# EasyEDA Pro project e-paper_ESP32-Pico-D4.epro

# Schematic ePaper
Create Date: 2024-11-13; Page Name: P1; Project Name: epaper; Schematic Name: ePaper; Update Date: 2024-11-18; Company: 嘉立创EDA; Drawed: Eikou; Page Size: A4; Reviewed: Bytecoin; Version: V1.0
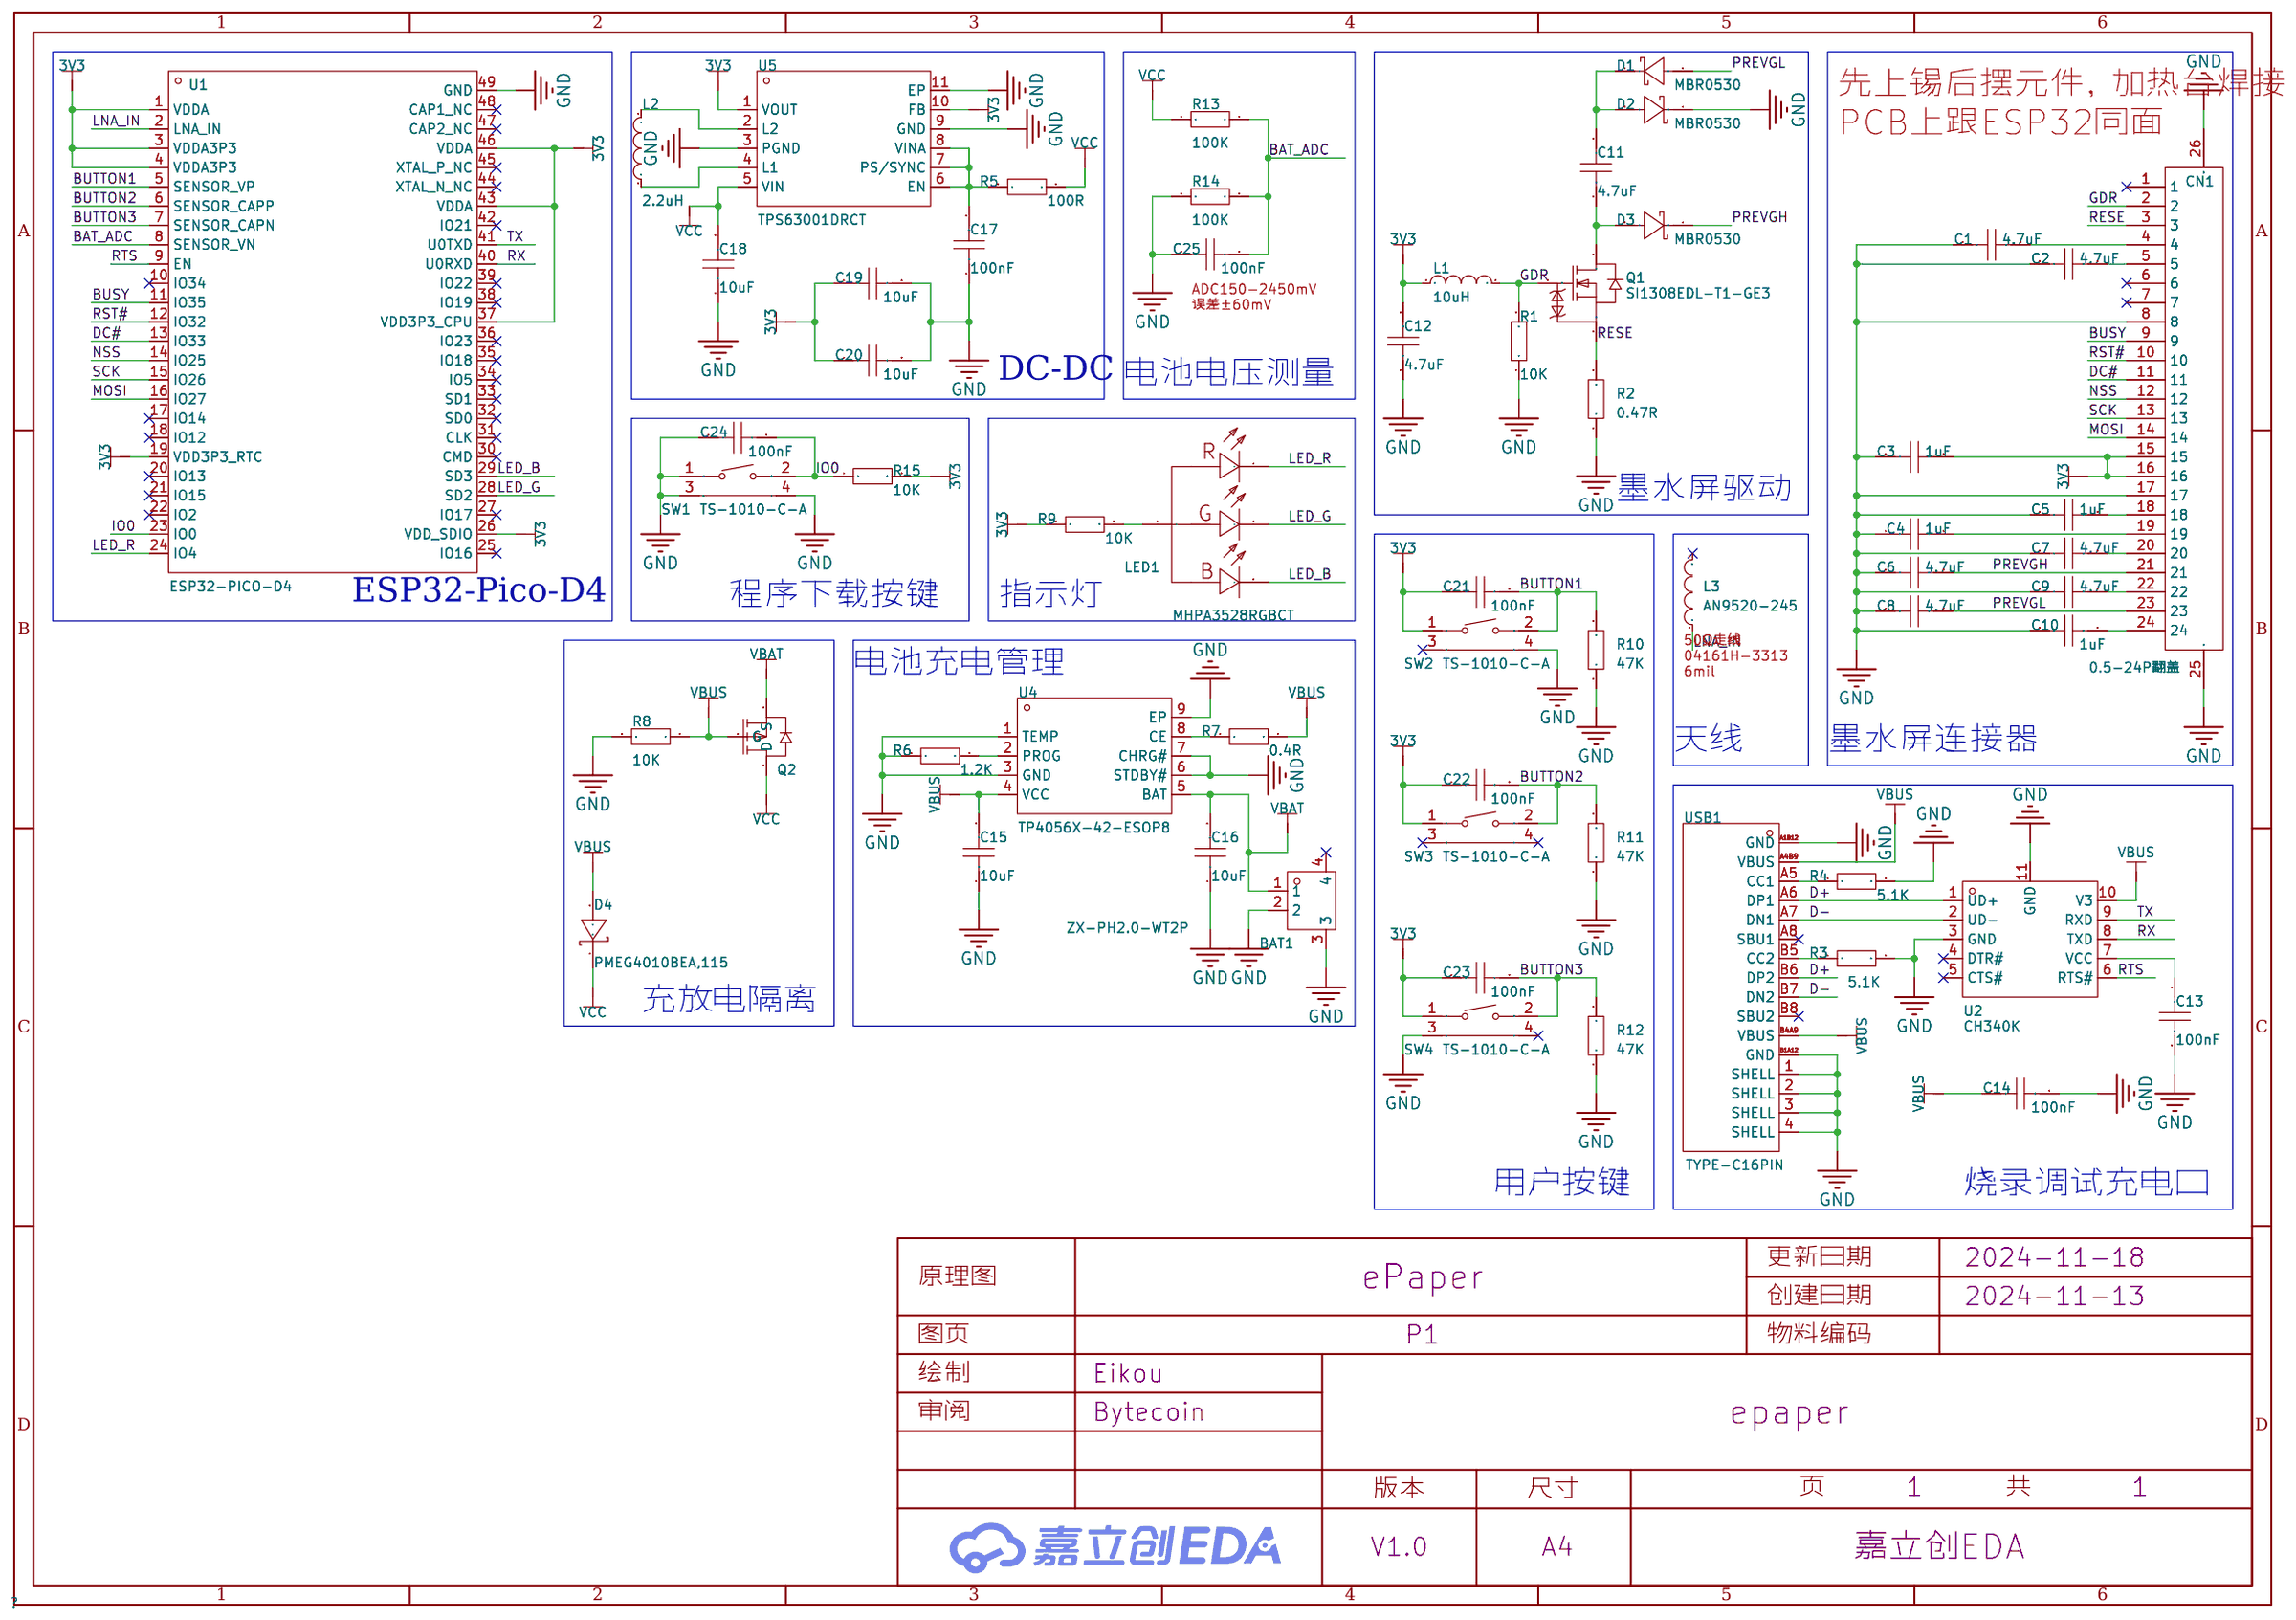
[diagram p0: schematic sheet]

## Parts
BAT1  ZX-PH2.0-WT2P  [CONN-SMD_ZX-PH2.0-WT2P]
C1  4.7uF  [C0603]
C2  4.7uF  [C0603]
C3  1uF  [C0603]
C4  1uF  [C0603]
C5  1uF  [C0603]
C6  4.7uF  [C0603]
C7  4.7uF  [C0603]
C8  4.7uF  [C0603]
C9  4.7uF  [C0603]
C10  1uF  [C0603]
C11  4.7uF  [C0603]
C12  4.7uF  [C0603]
C13  100nF  [C0603]
C14  100nF  [C0603]
C15  10uF  [C0603]
C16  10uF  [C0603]
C17  100nF  [C0603]
C18  10uF  [C0603]
C19  10uF  [C0603]
C20  10uF  [C0603]
C21  100nF  [C0603]
C22  100nF  [C0603]
C23  100nF  [C0603]
C24  100nF  [C0603]
C25  100nF  [C0603]
CN1  0.5-24P翻盖  [FPC-SMD_24P-P0.50-L6.1-W16.4]
D1  MBR0530  [SOD-123_L2.7-W1.6-LS3.7-RD-1]
D2  MBR0530  [SOD-123_L2.7-W1.6-LS3.7-RD-1]
D3  MBR0530  [SOD-123_L2.7-W1.6-LS3.7-RD-1]
D4  PMEG4010BEA,115  [SOD-323_L1.8-W1.3-LS2.5-RD]
L1  10uH  [IND-SMD_L4.6-W4.1]
L2  2.2uH  [IND-SMD_L4.6-W4.1]
L3  AN9520-245  [ANT-SMD_L9.5-W2.1]
LED1  MHPA3528RGBCT  [LED-ARRAY-SMD_4P-L3.5-W2.8-TL]
Q1  SI1308EDL-T1-GE3  [SOT-323_L2.0-W1.3-P1.30-LS2.1-BR]
Q2  -  [AO3401A_SOT-23-3]
R1  10K  [R0603]
R2  0.47R  [R0603]
R3  5.1K  [R0603]
R4  5.1K  [R0603]
R5  100R  [R0603]
R6  1.2K  [R0603]
R7  0.4R  [R0603]
R8  10K  [R0603]
R9  10K  [R0603]
R10  47K  [R0603]
R11  47K  [R0603]
R12  47K  [R0603]
R13  100K  [R0603]
R14  100K  [R0603]
R15  10K  [R0603]
SW1  TS-1010-C-A  [KEY-SMD_TX-1010-X-X]
SW2  TS-1010-C-A  [KEY-SMD_TX-1010-X-X]
SW3  TS-1010-C-A  [KEY-SMD_TX-1010-X-X]
SW4  TS-1010-C-A  [KEY-SMD_TX-1010-X-X]
U1  ESP32-PICO-D4  [LGA-48_L7.0-W7.0-P0.50-BL-EP5.4]
U2  CH340K  [ESOP-10_L4.9-W3.9-P1.00-LS6.0-BL-EP]
U4  TP4056X-42-ESOP8  [SOP-8_L4.9-W3.9-P1.27-LS6.0-TL-EP]
U5  TPS63001DRCT  [VSON-10_L3.0-W3.0-P0.50-TL-EP]
USB1  TYPE-C16PIN  [USB-C-SMD_TYPE-C16PIN]

## Library data of the parts
BAT1 = ZX-PH2.0-WT2P: 插针结构:1x2P;间距:2mm;安装方式:卧贴;参考系列:PH;总PIN数:2P;排数:1;每排PIN数:2;行距:-;额定电流:2A;触头材质:黄铜;触头镀层:锡;工作温度范围:-25℃~+85℃;; Supplier Part: C7429689; Manufacturer: Megastar(兆星); Supplier Footprint: SMD,P=2mm,卧贴; JLCPCB Part Class: Extended Part; Datasheet: https://atta.szlcsc.com/upload/public/pdf/source/20230619/22F856A07318150DB50BEAE33DC9B491.pdf; Supplier: LCSC; Pins Structure: 1x2P; Pitch: 2mm; Mounting Style: 卧贴; Reference Series: PH; Number of Pins: 2P; Number of Rows: 1; Number of PINs Per Row: 2; Current Rating (Max): 2A; Contact Material: 黄铜; Contact Plating: 锡; Operating Temperature Range: -25℃~+85℃
C1-C25 = CAP_0603: Supplier Footprint: 0603
CN1 = 0.5-24P翻盖: 间距:0.5mm;触点数量:24P;锁定特性:翻盖式;触点类型:下接;安装类型:卧贴;工作温度范围:-;; LCSC Part Name: 间距:0.5mm P数:24P 翻盖式 下接; Supplier Part: C20688; Manufacturer: BOOMELE(博穆精密); Supplier Footprint: SMD,P=0.5mm,卧贴; Datasheet: https://atta.szlcsc.com/upload/public/pdf/source/20210518/C2835077_01BB588238C9E5C5C5B2931B95D00EB1.pdf; Supplier: LCSC; Pitch: 0.5mm; Number of Contacts: 24P; Locking Feature: 翻盖式; FFC, FCB Thickness: 0.3mm; Contact Type: 下接; Mounting Type: 卧贴; Height Above Board: 2mm
D1-D3 = MBR0530_C5204746: 二极管配置:独立式;正向压降(Vf):500mV@500mA;直流反向耐压(Vr):30V;整流电流:500mA;; LCSC Part Name: 电压:30V 电流:500mA; Supplier Part: C5204746; Manufacturer: TWGMC(台湾迪嘉); Supplier Footprint: SOD-123; Datasheet: https://atta.szlcsc.com/upload/public/pdf/source/20221019/9AF996FD812938C8CF6407F410FBBCF7.pdf; Supplier: LCSC; Diode Configuration: 独立式; Forward Voltage (Vf@If): 500mV@500mA; Reverse Voltage (Vr): 30V; Rectified Current: 500mA; Reverse Leakage Current (Ir): 130uA
D4 = PMEG4010BEA,115: 正向压降(Vf):640mV@1A;直流反向耐压(Vr):40V;平均整流电流(Io):1A;; LCSC Part Name: 电压:40V 电流:1A; Supplier Part: C36975; Manufacturer: Nexperia(安世); Supplier Footprint: SOD-323; JLCPCB Part Class: Extended Part; Datasheet: https://atta.szlcsc.com/upload/public/pdf/source/20140924/1457707241864.pdf; Supplier: LCSC; Forward Voltage (Vf@If): 640mV@1A; Reverse Voltage (Vr): 40V; Average Rectified Current (Io): 1A; Reverse Leakage Current (Ir): 100uA@40V; Diode Configuration: 独立式; Rectified Current: 1A
L1 = CKST0402-6.8uH/M: 电感值:6.8uH;精度:±20%;额定电流:2A;饱和电流(Isat):2.5A;类型:一体成型电感;; LCSC Part Name: 6.8uH ±20% 2.5A; Supplier Part: C3002597; Manufacturer: CENKER(岑科); Manufacturer Part: CKST0402-10uH/M; Supplier Footprint: SMD,4.6x4.1mm; Datasheet: https://atta.szlcsc.com/upload/public/pdf/source/20220510/B48FE89972EB9627500571FF6CB43AFA.pdf; Supplier: LCSC; Tolerance: ±20%; Rated Current: 2A; Saturation Current (Isat): 2.5A; DC Resistance (DCR): 178mΩ; Type: 一体成型电感
L2 = CKST0402-6.8uH/M: 电感值:6.8uH;精度:±20%;额定电流:2A;饱和电流(Isat):2.5A;类型:一体成型电感;; LCSC Part Name: 6.8uH ±20% 2.5A; Supplier Part: C3002594; Manufacturer: CENKER(岑科); Manufacturer Part: CKST0402-2.2uH/M; Supplier Footprint: SMD,4.6x4.1mm; Datasheet: https://atta.szlcsc.com/upload/public/pdf/source/20220510/B48FE89972EB9627500571FF6CB43AFA.pdf; Supplier: LCSC; Tolerance: ±20%; Rated Current: 2A; Saturation Current (Isat): 2.5A; DC Resistance (DCR): 178mΩ; Type: 一体成型电感
L3 = AN9520-245: 2.4G陶瓷天线/适用于WIFI蓝牙; Supplier Part: C99665; Manufacturer: rainsun(霖昱微); Supplier Footprint: SMD,2.1x9.5mm; JLCPCB Part Class: 扩展库; Datasheet: https://atta.szlcsc.com/upload/public/pdf/source/20170425/1493115807294.pdf; Supplier: LCSC
LED1 = MHPA3528RGBCT: LCSC Part Name: RGB三色; Supplier Part: C409779; Manufacturer: MEIHUA(美华); Supplier Footprint: SMD3528; JLCPCB Part Class: 扩展库; Datasheet: https://atta.szlcsc.com/upload/public/pdf/source/20190902/C409779_9EA0C46D876E94D2A4E683BAC3DDD702.pdf; Supplier: LCSC
Q1 = SI1308EDL-T1-GE3: 类型:N沟道;漏源电压(Vdss):30V;连续漏极电流(Id):1.4A;功率(Pd):400mW；500mW;导通电阻(RDS(on)@Vgs,Id):132mΩ@10V,1.4A;; LCSC Part Name: N沟道 30V 1.4A; Supplier Part: C469327; Manufacturer: VISHAY(威世); Supplier Footprint: SOT-323; Datasheet: https://atta.szlcsc.com/upload/public/pdf/source/20191217/C469327_3FE8BCBB7604A1B1F6779A1D9DD725BB.pdf; Supplier: LCSC; Type: N沟道; Drain Source Voltage (Vdss): 30V; Continuous Drain Current (Id): 1.4A; Power Dissipation (Pd): 400mW；500mW; Drain Source On Resistance (RDS(on)@Vgs,Id): 132mΩ@10V,1.4A; Gate Threshold Voltage (Vgs(th)@Id): 1.5V@250uA; Total Gate Charge (Qg@Vgs): 4.1nC@10V; Input Capacitance (Ciss@Vds): 105pF@15V; Operating Temperature: -55℃~+150℃@(Tj)
Q2 = AO3401A_P: Supplier Footprint: SOT-23-3L; Supplier Part: C15127
R1-R15 = Res_0603: Supplier Footprint: 0603
SW1-SW4 = TS-1010-C-A: 电路结构:单刀单掷;按钮形状:矩形按钮;作用力:260gf;安装方式:卧贴;开关长度:2.3mm;开关宽度:4.7mm;开关高度:3.5mm;带支架:不带;触点电流:50mA;额定电压(AC):-;额定电压(DC):12V;额定功率:-;绝缘电阻:-;带灯:无;机械寿命:10万次;; LCSC Part Name: 2.3*4.7*3.5mm 卧贴 轻触开关; Supplier Part: C692458; Manufacturer: XKB Connectivity(中国星坤); Supplier Footprint: SMD; JLCPCB Part Class: 扩展库; Datasheet: https://atta.szlcsc.com/upload/public/pdf/source/20211011/09621D275CE0F472C941775DFBBCCC96.pdf; Supplier: LCSC; Circuit: 单刀单掷; Actuator Style: 矩形按钮; Operating Force: 260gf; Mounting Style: 卧贴; Switch Length: 2.3mm; Switch Width: 4.7mm; Switch Height: 3.5mm; Strike Gundam: 不带; Contact Current: 50mA; Voltage Rating (DC): 12V; Actuator/Cap Color: 黑色; With Lamp: 无; Mechanical Life: 10万次; Operating Temperature: -30℃~+85℃
U1 = ESP32-PICO-D4: 频率范围:2.4GHz~2.5GHz;接口:ADC, SDIO, SPI, PWM, UART, I2C, I2S, GPIO;应用领域:蓝牙,WiFi;数据速率:-;灵敏度:-;典型应用频率:-;; LCSC Part Name: 集成2.4GHz WIFI和蓝牙的模组; Supplier Part: C193707; Manufacturer: ESPRESSIF(乐鑫); Supplier Footprint: QFN-48-EP(7x7); Datasheet: https://atta.szlcsc.com/upload/public/pdf/source/20180531/C193707_20E6BADDB6EC95F0C0D505BA515D2866.pdf; Supplier: LCSC; Frequency Range: 2.4GHz~2.5GHz; Interface: ADC, SDIO, SPI, PWM, UART, I2C, I2S, GPIO; Operating Voltage: 2.7V~3.6V; Applications: 蓝牙,WiFi; Operating Temperature: -40℃~+85℃
U2 = CH340K_C18208922: 应用功能:USB转串口;接口协议:USB 2.0;通道数:1;数据速率:2Mbps;; LCSC Part Name: CH340K 人工转编带; Supplier Part: C18208922; Manufacturer: WCH(南京沁恒); Supplier Footprint: ESSOP-10-150mil-1mm; Datasheet: https://atta.szlcsc.com/upload/public/pdf/source/20240313/9D833A30DDFD16C064A7ADE10A944019.pdf; Supplier: LCSC; Applications Function: USB转串口; Protocol: USB 2.0; Number of Channels: 1; Supply Voltage: 3.3V；5V; Data Rate: 2Mbps; Operating Temperature: -20℃~+70℃
U4 = TP4056X-42-ESOP8: Supplier Part: C2763448; Manufacturer: TOPPOWER(南京拓微); Supplier Footprint: SOP-8-EP; JLCPCB Part Class: 扩展库; Datasheet: https://atta.szlcsc.com/upload/public/pdf/source/20221111/3D7D53D5011BF4ED4C4D0D9BFDBB1404.pdf; Supplier: LCSC
U5 = TPS63001DRCT: 功能类型:升降压型;输出类型:固定;输入电压:1.8V~5.5V;输出电压:3.3V;输出电流:1.6A;; LCSC Part Name: TPS6300x 高效单电感降压-升压转换器; Supplier Part: C2070693; Manufacturer: TI(德州仪器); Supplier Footprint: VSON-10-EP(3x3); JLCPCB Part Class: 扩展库; Datasheet: https://www.ti.com/cn/lit/gpn/tps63000; Supplier: LCSC; Function: 升降压型; Output Type: 固定; Input Voltage: 1.8V~5.5V; Output Voltage: 3.3V; Output Current: 1.6A; Switching Frequency: 1.5MHz; Operating Temperature: -40℃~+85℃@(TA); Synchronous Rectification: 是; Number of Outputs: 1; Topology: 降压-升压式; Switch tube (built-in/external): 内置
USB1 = TYPE-C16PIN: 连接器类型:Type-C;标准:-;公母:母座;触点数量:16;端口数量:1;安装方式:卧贴;额定电流 - 电源:3A;工作温度范围:-40~+85;; LCSC Part Name: Type-C 母座 卧贴 停产 快充闪充 停产; Supplier Part: C393939; Manufacturer: SHOU HAN(首韩); Supplier Footprint: SMD; JLCPCB Part Class: 扩展库; Datasheet: https://atta.szlcsc.com/upload/public/pdf/source/20190521/C393939_7B9043D4CF1026AF443AB60D91FBCD5C.pdf; Supplier: LCSC; Connector Type: Type-C; Gender: 母座; Number of Contacts: 16; Number of Ports: 1; Mounting Style: 卧贴; Current Rating - Power (Max): 3A; Operating Temperature Range: -40~+85

## Nets
3V3: C3.2 C12.2 C19.1 C20.1 C21.1 C22.1 C23.1 CN1.15 CN1.16 L1.1 R9.1 R15.2 SW2.1 SW3.1 SW4.1 U1.1(VDDA) U1.3(VDDA3P3) U1.4(VDDA3P3) U1.19(VDD3P3_RTC) U1.26(VDD_SDIO) U1.37(VDD3P3_CPU) U1.43(VDDA) U1.46(VDDA) U5.1(VOUT) U5.10(FB)
GND: BAT1.2 BAT1.3 C1.1 C2.1 C3.1 C4.1 C5.1 C6.1 C7.1 C8.1 C9.1 C10.1 C12.1 C13.2 C14.2 C15.1 C16.1 C17.1 C18.1 C19.2 C20.2 C24.1 C25.1 CN1.8 CN1.17 CN1.25 CN1.26 D2.1(K) R1.1 R2.1 R3.2 R4.2 R6.1 R8.2 R10.1 R11.1 R12.1 R14.2 SW1.1 SW1.3 SW1.4 SW2.4 SW4.3 U1.49(GND) U2.3(GND) U2.11(GND) U4.1(TEMP) U4.3(GND) U4.6(STDBY#) U4.7(CHRG#) U4.9(EP) U5.3(PGND) U5.9(GND) U5.11(EP) USB1.1(SHELL) USB1.2(SHELL) USB1.3(SHELL) USB1.4(SHELL) USB1.A1B12(GND) USB1.B1A12(GND)
VBAT: BAT1.1 C16.2 Q2.2(S) U4.5(BAT)
VBUS: C14.1 C15.2 D4.2(A) Q2.1(G) R7.2 R8.1 U2.10(V3) U4.4(VCC) USB1.A4B9(VBUS) USB1.B4A9(VBUS)
VCC: C18.2 D4.1(K) Q2.3(D) R5.2 R13.2 U5.5(VIN)
BAT_ADC: C25.2 R13.1 R14.1 U1.8(SENSOR_VN)
BUSY: CN1.9 U1.11(IO35)
BUTTON1: C21.2 R10.2 SW2.2 U1.5(SENSOR_VP)
BUTTON2: C22.2 R11.2 SW3.2 U1.6(SENSOR_CAPP)
BUTTON3: C23.2 R12.2 SW4.2 U1.7(SENSOR_CAPN)
D+: U2.1(UD+) USB1.A6(DP1) USB1.B6(DP2)
D-: U2.2(UD-) USB1.A7(DN1) USB1.B7(DN2)
DC#: CN1.11 U1.13(IO33)
GDR: CN1.2 L1.2 Q1.1(G) R1.2
IO0: C24.2 R15.1 SW1.2 U1.23(IO0)
LED_B: LED1.2(-) U1.29(SD3)
LED_G: LED1.3(-) U1.28(SD2)
LED_R: LED1.4(-) U1.24(IO4)
LNA_IN: L3.1 U1.2(LNA_IN)
MOSI: CN1.14 U1.16(IO27)
NSS: CN1.12 U1.14(IO25)
PREVGH: C6.2 CN1.21 D3.1(K)
PREVGL: C8.2 CN1.23 D1.2(A)
RESE: CN1.3 Q1.2(S) R2.2
RST#: CN1.10 U1.12(IO32)
RTS: U1.9(EN) U2.6(RTS#)
RX: U1.40(U0RXD) U2.8(TXD)
SCK: CN1.13 U1.15(IO26)
TX: U1.41(U0TXD) U2.9(RXD)
$1N2221: C10.2 CN1.24
$1N2224: C9.2 CN1.22
$1N2227: C7.2 CN1.20
$1N2228: C5.2 CN1.18
$1N2229: C4.2 CN1.19
$1N2234: C2.2 CN1.5
$1N2235: C1.2 CN1.4
$1N2259: C11.2 D1.1(K) D2.2(A)
$1N2263: C11.1 D3.2(A) Q1.3(D)
$1N6417: C13.1 U2.7(VCC)
$1N6894: L2.2 U5.2(L2)
$1N6899: L2.1 U5.4(L1)
$1N7477: R6.2 U4.2(PROG)
$1N8017: R7.1 U4.8(CE)
$1N8958: C17.2 R5.1 U5.6(EN) U5.7(PS/SYNC) U5.8(VINA)
$1N11198: LED1.1(-) R9.2
$1N13336: R4.1 USB1.A5(CC1)
$1N13383: R3.1 USB1.B5(CC2)

Not connected (* = marked no-connect by the designer): BAT1 4*; CN1 1* 6* 7*; L3 2*; SW2 3*; SW3 3* 4*; SW4 4*; U1 10(IO34)* 17(IO14)* 18(IO12)* 20(IO13)* 21(IO15)* 22(IO2)* 25(IO16)* 27(IO17)* 30(CMD)* 31(CLK)* 32(SD0)* 33(SD1)* 34(IO5)* 35(IO18)* 36(IO23)* 38(IO19)* 39(IO22)* 42(IO21)* 44(XTAL_N_NC)* 45(XTAL_P_NC)* 47(CAP2_NC)* 48(CAP1_NC)*; U2 4(DTR#)* 5(CTS#)*; USB1 A8(SBU1)* B8(SBU2)*

## Notes on the sheet
- 先上锡后摆元件，加热台焊接
  PCB上跟ESP32同面
- ADC150-2450mV
  误差±60mV
- DC-DC
- 电池电压测量
- 墨水屏驱动
- ESP32-Pico-D4
- 程序下载按键
- 指示灯
- 电池充电管理
- 50Ω走线
  04161H-3313
  6mil
- 天线
- 墨水屏连接器
- 充放电隔离
- 用户按键
- 烧录调试充电口

# Board PCB2
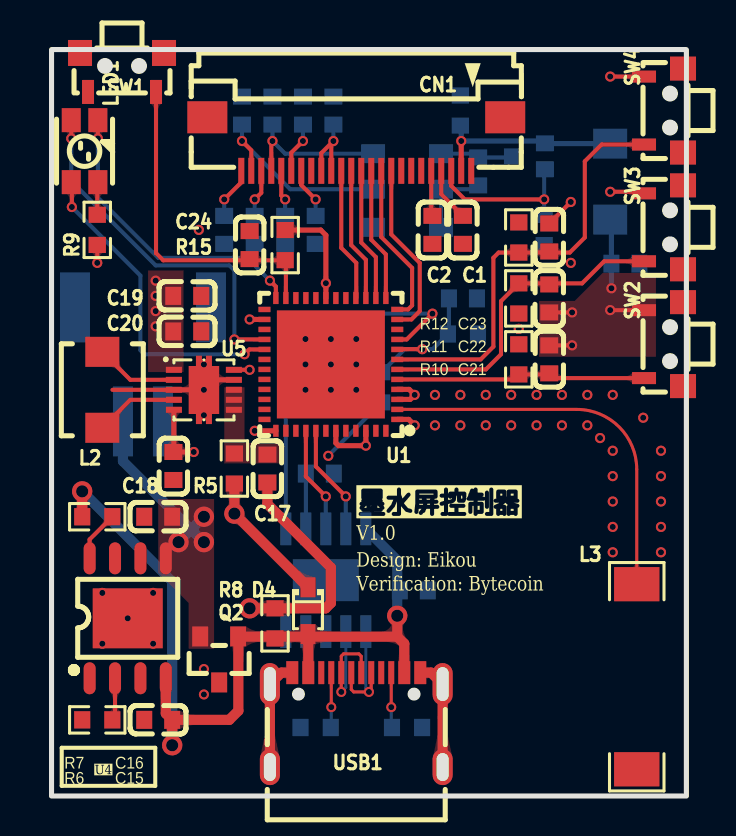
[diagram p1: board, top side]
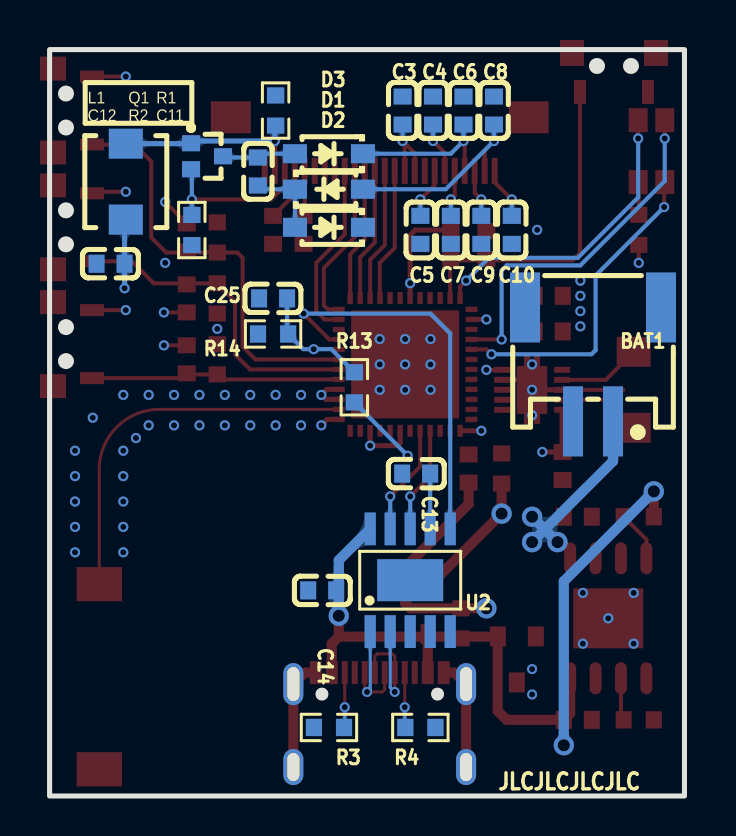
[diagram p2: board, bottom side, seen from below]

Outline 31.75 x 37.34 mm; copper layers: Top Layer, Inner1, Inner2, Bottom Layer. Coordinates in mm from the lower left corner of the outline.
Outline path: rectangle 0,37.34 31.75,0
Stack: Top Layer 0.035mm 外层铜厚1oz / Dielectric1 0.2104mm 7628 RC49% 8.6mil / Inner1 0.0152mm 内层铜厚 / Dielectric2 1.065mm 1.1mm H/HOZ 含铜 / Inner2 0.0152mm 内层铜厚 / Dielectric3 0.2104mm 7628 RC49% 8.6mil / Bottom Layer 0.035mm 外层铜厚1oz

## Design rules (mm)
template: 自定义配置
spacing copperThickness1oz (default): track to track 0.102, other pairs 0.152 to 0.3
spacing copperThickness2oz: track to track 0.203, other pairs 0.152 to 0.3
track width copperThickness1oz (default): min 0.127, default 0.254, max 2.54
track width copperThickness2oz: min 0.203, default 0.254, max 2.54
differential pair differentialPair (default): width min 0.127, default 0.254, max 2.54; gap min 0.152, default 0.152
via viaSize (default): diameter min 0.5, default 0.61, max 10; hole min 0.3, default 0.305, max 6.299

## Placement (name value [footprint] x y rotation side)
BAT1  ZX-PH2.0-WT2P  [CONN-SMD_ZX-PH2.0-WT2P]  4.57 21.59 0 bottom
C1  4.7uF  [C0603]  20.57 28.32 90 top
C2  4.7uF  [C0603]  19.05 28.32 90 top
C3  1uF  [C0603]  14.1 34.29 270 bottom
C4  1uF  [C0603]  12.57 34.29 270 bottom
C5  1uF  [C0603]  13.21 28.32 90 bottom
C6  4.7uF  [C0603]  11.05 34.29 270 bottom
C7  4.7uF  [C0603]  11.68 28.32 90 bottom
C8  4.7uF  [C0603]  9.53 34.29 270 bottom
C9  4.7uF  [C0603]  10.16 28.32 90 bottom
C10  1uF  [C0603]  8.64 28.32 90 bottom
C11  4.7uF  [C0603]  21.34 31.24 270 bottom
C12  4.7uF  [C0603]  28.7 26.63 180 bottom
C13  100nF  [C0603]  13.42 16.13 0 bottom
C14  100nF  [C0603]  18.12 10.29 0 bottom
C15  10uF  [C0603]  5.33 3.81 0 top
C16  10uF  [C0603]  5.33 13.97 0 top
C17  100nF  [C0603]  10.79 16.38 90 top
C18  10uF  [C0603]  6.1 16.51 90 top
C19  10uF  [C0603]  6.79 25.02 0 top
C20  10uF  [C0603]  6.79 23.24 0 top
C21  100nF  [C0603]  24.89 21.84 270 top
C22  100nF  [C0603]  24.89 24.89 90 top
C23  100nF  [C0603]  24.89 27.94 270 top
C24  100nF  [C0603]  9.91 27.56 270 top
C25  100nF  [C0603]  20.57 24.89 180 bottom
CN1  0.5-24P翻盖  [FPC-SMD_24P-P0.50-L6.1-W16.4]  15.24 32.61 180 top
D1  MBR0530  [SOD-123_L2.7-W1.6-LS3.7-RD-1]  17.78 30.35 180 bottom
D2  MBR0530  [SOD-123_L2.7-W1.6-LS3.7-RD-1]  17.78 28.45 0 bottom
D3  MBR0530  [SOD-123_L2.7-W1.6-LS3.7-RD-1]  17.78 32.13 0 bottom
D4  PMEG4010BEA,115  [SOD-323_L1.8-W1.3-LS2.5-RD]  12.83 9.27 270 top
L1  10uH  [IND-SMD_L4.6-W4.1]  27.94 30.73 90 bottom
L2  2.2uH  [IND-SMD_L4.6-W4.1]  2.54 20.32 90 top
L3  AN9520-245  [ANT-SMD_L9.5-W2.1]  29.27 5.97 270 top
LED1  MHPA3528RGBCT  [LED-ARRAY-SMD_4P-L3.5-W2.8-TL]  1.65 32.26 270 top
Q1  SI1308EDL-T1-GE3  [SOT-323_L2.0-W1.3-P1.30-LS2.1-BR]  23.88 32 0 bottom
Q2  -  [AO3401A_SOT-23-3]  8.38 6.83 90 top
R1  10K  [R0603]  20.45 34.29 270 bottom
R2  0.47R  [R0603]  24.64 28.31 90 bottom
R3  5.1K  [R0603]  17.78 3.43 0 bottom
R4  5.1K  [R0603]  13.21 3.43 180 bottom
R5  100R  [R0603]  9.14 16.38 270 top
R6  1.2K  [R0603]  2.29 3.81 0 top
R7  0.4R  [R0603]  2.29 13.97 180 top
R8  10K  [R0603]  11.18 8.64 90 top
R9  10K  [R0603]  2.29 28.32 90 top
R10  47K  [R0603]  23.37 21.84 270 top
R11  47K  [R0603]  23.37 24.89 90 top
R12  47K  [R0603]  23.37 27.94 270 top
R13  100K  [R0603]  16.51 20.45 270 bottom
R14  100K  [R0603]  20.57 23.11 0 bottom
R15  10K  [R0603]  11.68 27.56 90 top
SW1  TS-1010-C-A  [KEY-SMD_TX-1010-X-X]  3.53 36.19 0 top
SW2  TS-1010-C-A  [KEY-SMD_TX-1010-X-X]  30.61 22.61 270 top
SW3  TS-1010-C-A  [KEY-SMD_TX-1010-X-X]  30.61 28.45 270 top
SW4  TS-1010-C-A  [KEY-SMD_TX-1010-X-X]  30.61 34.29 270 top
U1  ESP32-PICO-D4  [LGA-48_L7.0-W7.0-P0.50-BL-EP5.4]  13.97 21.59 90 top
U2  CH340K  [ESOP-10_L4.9-W3.9-P1.00-LS6.0-BL-EP]  13.72 10.8 180 bottom
U4  TP4056X-42-ESOP8  [SOP-8_L4.9-W3.9-P1.27-LS6.0-TL-EP]  3.81 8.89 90 top
U5  TPS63001DRCT  [VSON-10_L3.0-W3.0-P0.50-TL-EP]  7.62 20.32 0 top
USB1  TYPE-C16PIN  [USB-C-SMD_TYPE-C16PIN]  15.24 3.81 0 top

## Footprints (pads in the part's own frame, mm; a bottom-side part is the same pattern mirrored in y, then rotated)
ANT-SMD_L9.5-W2.1
  rect 1.71x2.268 smd: 1(-4.63,0) 2(4.63,0)
AO3401A_SOT-23-3
  rect 1x0.8 smd: 1(1.15,-0.95) 2(1.15,0.95) 3(-1.15,0)
C0603
  rect 0.8x0.9 smd: 1(-0.7,0) 2(0.7,0)
CONN-SMD_ZX-PH2.0-WT2P
  rect 1x3.5 smd: 1(-1,2.85) 2(1,2.85)
  rect 1.5x3.5 smd: 3(-3.4,-2.85) 4(3.4,-2.85)
ESOP-10_L4.9-W3.9-P1.00-LS6.0-BL-EP
  rect 0.56x1.64 smd: 1(-2,-2.57) 2(-1,-2.57) 3(0,-2.57) 4(1,-2.57) 5(2,-2.57) 6(2,2.57) 7(1,2.57) 8(0,2.57) 9(-1,2.57) 10(-2,2.57)
  rect 3.3x2.1 smd: 11(0,0)
FPC-SMD_24P-P0.50-L6.1-W16.4
  rect 0.3x1.3 smd: 1(-5.75,1.34) 2(-5.25,1.34) 3(-4.75,1.34) 4(-4.25,1.34) 5(-3.75,1.34) 6(-3.25,1.34) 7(-2.75,1.34) 8(-2.25,1.34) 9(-1.75,1.34) 10(-1.25,1.34) 11(-0.75,1.34) 12(-0.25,1.34) 13(0.25,1.34) 14(0.75,1.34) 15(1.25,1.34) 16(1.75,1.34) 17(2.25,1.34) 18(2.75,1.34) 19(3.25,1.34) 20(3.75,1.34) 21(4.25,1.34) 22(4.75,1.34) 23(5.25,1.34) 24(5.75,1.34)
  rect 2x1.6 smd: 25(7.449,-1.34) 26(-7.449,-1.34)
IND-SMD_L4.6-W4.1
  rect 1.5x1.7 smd: 1(-1.9,0) 2(1.9,0)
KEY-SMD_TX-1010-X-X
  rect 0.6x1.2 smd: 1(-1.7,-0.975) 2(1.7,-0.975)
  rect 1.2x1.3 smd: 3(-2.1,0.975) 4(2.1,0.975)
LED-ARRAY-SMD_4P-L3.5-W2.8-TL
  rect 1.2x0.95 smd: 1(1.55,0.665) 2(1.55,-0.665) 3(-1.55,-0.665) 4(-1.55,0.665)
LGA-48_L7.0-W7.0-P0.50-BL-EP5.4
  rect 0.27x0.6 smd: 1(-2.75,-3.32) 2(-2.25,-3.32) 3(-1.75,-3.32) 4(-1.25,-3.32) 5(-0.75,-3.32) 6(-0.25,-3.32) 7(0.25,-3.32) 8(0.75,-3.32) 9(1.25,-3.32) 10(1.75,-3.32) 11(2.25,-3.32) 12(2.75,-3.32) 25(2.75,3.32) 26(2.25,3.32) 27(1.75,3.32) 28(1.25,3.32) 29(0.75,3.32) 30(0.25,3.32) 31(-0.25,3.32) 32(-0.75,3.32) 33(-1.25,3.32) 34(-1.75,3.32) 35(-2.25,3.32) 36(-2.75,3.32)
  rect 0.6x0.27 smd: 13(3.32,-2.75) 14(3.32,-2.25) 15(3.32,-1.75) 16(3.32,-1.25) 17(3.32,-0.75) 18(3.32,-0.25) 19(3.32,0.25) 20(3.32,0.75) 21(3.32,1.25) 22(3.32,1.75) 23(3.32,2.25) 24(3.32,2.75) 37(-3.32,2.75) 38(-3.32,2.25) 39(-3.32,1.75) 40(-3.32,1.25) 41(-3.32,0.75) 42(-3.32,0.25) 43(-3.32,-0.25) 44(-3.32,-0.75) 45(-3.32,-1.25) 46(-3.32,-1.75) 47(-3.32,-2.25) 48(-3.32,-2.75)
  rect 5.4x5.4 smd: 49(0,0)
R0603
  rect 0.806x0.864 smd: 1(-0.753,0) 2(0.753,0)
SOD-123_L2.7-W1.6-LS3.7-RD-1
  rect 1.2x0.95 smd: 1(-1.7,0) 2(1.7,0)
SOD-323_L1.8-W1.3-LS2.5-RD
  rect 1x0.75 smd: 1(-1.173,0) 2(1.173,0)
SOP-8_L4.9-W3.9-P1.27-LS6.0-TL-EP
  oval 1.6x0.6 smd: 1(-3,1.905) 2(-3,0.635) 3(-3,-0.635) 4(-3,-1.905) 5(3,-1.905) 6(3,-0.635) 7(3,0.635) 8(3,1.905)
  rect 3x3.5 smd: 9(0,0)
SOT-323_L2.0-W1.3-P1.30-LS2.1-BR
  rect 0.9x0.8 smd: 1(0.8,-0.65) 2(0.8,0.65) 3(-0.8,0)
USB-C-SMD_TYPE-C16PIN
  oval 1.001x2.1 hole 0.6x1.7: 1(-4.321,1.788) 2(4.321,1.788)
  oval 1.001x1.801 hole 0.6x1.399: 3(-4.321,-2.362) 4(4.321,-2.362)
  rect 0.6x1.151 smd: A1B12(-3.2,2.362) A4B9(-2.401,2.362) B1A12(3.2,2.362) B4A9(2.401,2.362)
  rect 0.299x1.151 smd: A5(-1.25,2.362) A6(-0.249,2.362) A7(0.249,2.362) A8(-1.75,2.362) B5(1.75,2.362) B6(0.75,2.362) B7(-0.75,2.362) B8(1.25,2.362)
VSON-10_L3.0-W3.0-P0.50-TL-EP
  rect 0.8x0.3 smd: 1(-1.5,1) 2(-1.5,0.5) 3(-1.5,0) 4(-1.5,-0.5) 5(-1.5,-1) 6(1.5,-1) 7(1.5,-0.5) 8(1.5,0) 9(1.5,0.5) 10(1.5,1)
  custom 1.52x3.42 smd: 11(0.002,-0.009)

## Nets
As in the schematic.

Pads without a net: BAT1 4; CN1 1 6 7; L3 2; SW2 3; SW3 3 4; SW4 4; U1 10 17 18 20 21 22 25 27 30 31 32 33 34 35 36 38 39 42 44 45 47 48; U2 4 5; USB1 A8 B8

## Via types
v1: diameter 0.508, hole 0.305, Top Layer to Bottom Layer, 88 vias
v2: diameter 1.016, hole 0.61, Top Layer to Bottom Layer, 8 vias
v3: diameter 0.5, hole 0.305, Top Layer to Bottom Layer, 6 vias

## Routing (per net, layer and track width the routed paths; a pad name or vN(x,y) marks a point on that pad's centre or on a via; arc(x,y) is an arc through that point)
3V3: length 31
  Top Layer w0.203: CN1.15 13.99,32.66 ; 13.99,32.66 v1(14.1,32.77) ; 13.99,32.66 13.49,32.16 CN1.16 ; SW4.1 v1(27.94,35.99) ; C23.1 v1(25.97,29.72) ; U5.10 v1(9.91,21.32) ; C21.1 v1(26.03,22.54) ; C22.1 v1(26.03,24.19) ; R9.1 v1(2.29,26.67) ; SW2.1 v1(27.94,24.31) ; v1(27.94,30.23) 29.55,30.23 SW3.1
  Top Layer w0.254: U1.19 v1(13.72,25.65) 13.72,28.05 13.46,28.31 R15.2 ; U1.4 17.89,20.34 v1(18.16,20.07) 17.94,19.84 U1.3 ; U1.46 v1(15.72,17.53) 14.35,17.53 14.22,17.66 U1.43 ; U1.1 17.86,18.84 v1(18.16,18.54) ; U1.26 v1(9.91,23.84) ; U1.37 v1(10.16,18.27)
  Bottom Layer w0.203: C3.2 v1(14.1,32.77)
  Bottom Layer w0.254: v1(28,25.4) C12.2 28,28.77 L1.1
  vias: v1(5.21,25.78) v1(5.21,25.02) v1(5.21,24.26) v1(5.21,23.5) v1(25.97,26.67)
GND: length 28.8
  Top Layer w0.203: 3.05,20.32 U5.3
  Top Layer w0.254: U5.3 7.61,20.32 U5.11 8.13,20.82 U5.9
  Top Layer w0.508: USB1.B1A12 18.99,6.17 USB1.2 USB1.4 ; USB1.A1B12 11.49,6.17 USB1.1 USB1.3 ; v2(9.91,9.39) R8.2 13.71,9.39 13.97,9.65 13.97,11.43 10.79,14.61 C17.1
  vias: v1(2.54,10.16) v1(2.54,7.62) v1(3.81,8.89) v1(5.08,10.16) v1(5.08,7.62) v1(7.37,28.32) v1(7.62,21.59) v1(7.62,20.32) v1(7.62,19.05) v1(12.7,22.86) v1(12.7,21.59) v1(12.7,20.32) v1(13.97,22.86) v1(13.97,21.59) v1(13.97,20.32) v1(15.24,22.86) v1(15.24,21.59) v1(15.24,20.32) v1(19.18,20.07) v1(19.18,18.54) v1(20.45,20.07) v1(20.45,18.54) v1(21.72,20.07) v1(21.72,18.54) v1(22.99,20.07) v1(22.99,18.54) v1(23.37,23.37) v1(24.26,20.07) v1(24.26,18.54) v1(25.53,20.07) v1(25.53,18.54) v1(26.8,20.07) v1(26.8,18.54) v1(27.43,17.91) v1(28.07,20.07) v1(28.07,17.27) v1(28.07,16) v1(28.07,14.73) v1(28.07,13.46) v1(28.07,12.19) v1(29.59,18.92) v1(30.48,17.27) v1(30.48,16) v1(30.48,14.73) v1(30.48,13.46) v1(30.48,12.19)
VBAT: length 9.5
  Bottom Layer w0.508: v2(7.62,13.97) 6.99,13.33 ; 6.99,13.33 v2(7.62,12.7) ; 6.99,13.33 v2(6.35,12.7) ; 6.99,13.33 3.57,16.75 BAT1.1
VBUS: length 44.6
  Top Layer w0.508: 12.83,7.97 12.84,7.96 USB1.A4B9 ; 12.83,7.97 17.29,7.97 ; 12.83,7.97 11.26,7.97 ; 17.29,7.97 v2(17.29,9.02) ; 17.29,7.97 17.64,7.62 USB1.B4A9 ; 11.26,7.97 9.34,7.97 ; 11.26,7.97 R8.1 ; 9.34,7.97 9.34,4.26 8.89,3.81 C15.2 ; 9.34,7.97 Q2.1 ; R7.2 v2(1.53,15.24) ; C15.2 v2(6.03,2.54) ; C15.2 5.72,4.13 U4.4
  Bottom Layer w0.508: U2.10 17.29,11.79 17.29,10.16 ; 17.29,10.16 C14.1 ; 17.29,10.16 v2(17.29,9.02) ; v2(1.53,15.24) 6.03,10.74 v2(6.03,2.54)
VCC: length 13.6
  Top Layer w0.254: U5.5 6.12,17.23 C18.2 v1(7.11,17.21)
  Top Layer w0.508: R5.2 v2(9.14,14.13) D4.1
  Bottom Layer w0.203: R13.2 13.84,17.03 v1(13.84,17.02)
  vias: v3(7.62,6.35) v3(7.62,5.08)
BAT_ADC: length 7.2
  Top Layer w0.203: U1.8 17.3,22.35 v1(18.54,22.35)
  Bottom Layer w0.203: C25.2 19.87,23.17 R14.1 19.06,22.35 v1(18.54,22.35) 17.66,22.35 R13.1
BUSY: length 8.9
  Top Layer w0.203: CN1.9 16.99,28.09 18.41,26.67 18.41,24.26 18,23.84 U1.11
BUTTON1: length 12.6
  Top Layer w0.203: U1.5 23.12,20.84 R10.2 24.84,21.09 C21.2 25.13,20.91 SW2.2
BUTTON2: length 16.2
  Top Layer w0.203: 24.84,25.65 R11.2 22.48,24.76 22.48,22.1 21.72,21.34 U1.6 ; 24.84,25.65 26.53,25.65 27.64,26.75 SW3.2 ; 24.84,25.65 C22.2
BUTTON3: length 21.7
  Top Layer w0.203: U1.7 21.46,21.84 22.1,22.48 22.1,26.92 22.36,27.19 R12.2 24.84,27.19 ; SW4.2 27.51,32.59 26.67,31.75 26.67,27.94 25.92,27.19 24.84,27.19 ; 24.84,27.19 C23.2
D+: length 5.9
  Top Layer w0.152: USB1.B6 15.99,5.32 v3(15.88,5.21) 15.11,5.21 14.99,5.33 USB1.A6
  Bottom Layer w0.152: v3(15.88,5.21) 15.72,5.37 15.72,8.22
D-: length 6.8
  Top Layer w0.152: v3(14.49,5.21) USB1.B7 14.49,7 14.6,7.11 15.37,7.11 15.49,6.99 USB1.A7
  Bottom Layer w0.152: 14.72,8.22 14.72,5.43 v3(14.49,5.21)
DC#: length 6.7
  Top Layer w0.203: CN1.11 15.99,27.83 16.72,27.09 U1.13
GDR: length 9.8
  Top Layer w0.254: CN1.2 v1(20.49,32.77)
  Bottom Layer w0.254: R1.2 20.49,33.49 v1(20.49,32.77) 24.56,32.77 Q1.1 24.7,32.63 L1.2
IO0: length 16.6
  Top Layer w0.203: U1.23 11.72,26.77 R15.1 11.68,26.8 5.59,26.8 5.22,27.16 SW1.2
LED_B: length 16.2
  Top Layer w0.203: v1(1.02,29.46) 1.02,30.68 LED1.2 ; v1(9.65,22.1) 9.89,22.34 U1.29
  Bottom Layer w0.203: v1(1.02,29.46) 4.44,26.03 4.44,22.3 4.65,22.1 v1(9.65,22.1)
LED_G: length 18
  Top Layer w0.203: LED1.3 v1(0.99,32.89) ; U1.28 v1(9.14,22.84)
  Bottom Layer w0.203: v1(0.99,32.89) 0.99,30.76 5.21,26.54 8.89,26.54 9.14,26.29 v1(9.14,22.84)
LED_R: length 15.2
  Top Layer w0.203: v1(10.92,25.78) 11.22,25.48 U1.24 ; LED1.4 v1(2.32,32.89)
  Bottom Layer w0.203: v1(10.92,25.78) 9.78,26.92 5.33,26.92 2.32,29.94 v1(2.32,32.89)
LNA_IN: length 19.4
  Top Layer w0.152: L3.1 29.27,16.34 arc(28.39,18.46) 26.27,19.34 U1.2
MOSI: length 6.7
  Top Layer w0.203: CN1.14 14.49,27.42 15.24,26.67 15.24,24.93 U1.16
NSS: length 6.7
  Top Layer w0.203: U1.14 16.22,26.96 15.49,27.69 CN1.12
PREVGH: length 7.6
  Top Layer w0.203: CN1.21 10.99,32.71 v1(11.05,32.77)
  Bottom Layer w0.203: C6.2 v1(11.05,32.77) 11.68,32.13 D3.1
PREVGL: length 10.1
  Top Layer w0.203: CN1.23 9.99,32.3 v1(9.53,32.77)
  Bottom Layer w0.203: D1.2 11.94,30.35 v1(9.53,32.77) C8.2
RESE: length 8
  Top Layer w0.203: CN1.3 19.99,30.52 20.67,29.84 v1(24.64,29.84)
  Bottom Layer w0.203: 24.64,29.07 v1(24.64,29.84) 24.64,31.32 Q1.2
RST#: length 8.2
  Top Layer w0.203: U1.12 17.83,24.34 18.03,24.54 18.03,26.42 16.49,27.96 CN1.10
RTS: length 19.8
  Top Layer w0.203: U1.9 17.76,22.84 v1(19.05,24.13)
  Bottom Layer w0.203: U2.6 11.72,23.15 12.7,24.13 v1(19.05,24.13)
RX: length 5.3
  Top Layer w0.203: v1(13.72,14.99) 12.72,15.98 U1.40
  Bottom Layer w0.203: U2.8 v1(13.72,14.99)
SCK: length 6.7
  Top Layer w0.203: U1.15 15.72,26.83 14.99,27.56 14.99,31.27 CN1.13
TX: length 5.5
  Top Layer w0.203: U1.41 13.22,16.48 v1(14.72,14.99)
  Bottom Layer w0.203: U2.9 v1(14.72,14.99)
$1N2221: length 2.6
  Top Layer w0.203: v1(8.64,29.84) 9.49,30.7 CN1.24
  Bottom Layer w0.203: C10.2 v1(8.64,29.84)
$1N2224: length 2.4
  Top Layer w0.203: v1(10.16,29.84) 10.49,30.17 CN1.22
  Bottom Layer w0.203: C9.2 v1(10.16,29.84)
$1N2227: length 2.3
  Top Layer w0.203: CN1.20 11.49,30.04 v1(11.68,29.84)
  Bottom Layer w0.203: C7.2 v1(11.68,29.84)
$1N2228: length 2.5
  Top Layer w0.203: CN1.18 12.49,30.56 v1(13.21,29.84)
  Bottom Layer w0.203: C5.2 v1(13.21,29.84)
$1N2229: length 2.6
  Top Layer w0.203: v1(12.57,32.77) 11.99,32.18 CN1.19
  Bottom Layer w0.203: C4.2 v1(12.57,32.77)
$1N2234: length 2.3
  Top Layer w0.203: C2.2 18.99,29.08 CN1.5
$1N2235: length 2.7
  Top Layer w0.203: CN1.4 19.49,30.11 C1.2
$1N2259: length 3.8
  Bottom Layer w0.203: D2.2 D1.1 21.15,30.35 C11.2
$1N2263: length 3.7
  Bottom Layer w0.203: D3.2 21.15,32.13 C11.1 23.01,31.94 Q1.3
$1N6417: length 2.8
  Bottom Layer w0.203: C13.1 12.72,13.37 U2.7
$1N6894: length 4.2
  Top Layer w0.203: L2.2 3.94,20.82 U5.2
$1N6899: length 4.2
  Top Layer w0.203: U5.4 3.94,19.82 L2.1
$1N7477: length 2.1
  Top Layer w0.203: R6.2 3.18,3.95 U4.2
$1N8017: length 2.5
  Top Layer w0.203: U4.8 1.91,12.84 R7.1
$1N11198: length 1.6
  Top Layer w0.203: R9.2 2.29,30.68 LED1.1
$1N13336: length 2.8
  Top Layer w0.152: USB1.A5 v3(13.99,4.44)
  Bottom Layer w0.152: R4.1 13.99,3.46 v3(13.99,4.44)
$1N13383: length 2.8
  Top Layer w0.152: USB1.B5 v3(16.99,4.44)
  Bottom Layer w0.152: R3.1 16.99,3.47 v3(16.99,4.44)

## Copper pours and planes (outline as drawn; the poured copper is in the pictures)
3V3 on Top Layer: 24.38,26.16 30.23,26.16 30.23,21.97 24.38,21.97
3V3 on Top Layer: 4.83,26.29 6.6,26.29 6.6,21.21 4.83,21.21
3V3 on Inner2: 0.26,37.08 31.49,37.08 31.49,0.26 0.26,0.26
GND on Top Layer: 0,37.34 31.75,37.34 31.75,0 0,0
GND on Bottom Layer: 0,37.34 31.75,37.34 31.75,0 0,0
GND on Inner1: 0.26,37.08 31.49,37.08 31.49,0.26 0.26,0.26
VBAT on Top Layer: 5.33,14.86 8.13,14.86 8.13,7.37 5.33,7.37
VCC on Top Layer: 6.35,6.98 6.35,4.44 8.89,4.44 8.89,6.98
VCC on Inner2: 0.26,17.65 15.04,17.65 15.04,0.26 0.26,0.26
$1N8958 on Top Layer: 8.64,20.45 11.43,20.45 11.43,16.64 8.64,16.64

Small or netless copper shapes (teardrops, artwork), in the pictures only: 184 on Top Layer, 85 on Bottom Layer, 14 on Inner1

## Text on the board
Bottom Silkscreen Layer: JLCJLCJLCJLC
Top Silkscreen Layer: V1.0 | Design: Eikou / Verification: Bytecoin | 墨水屏控制器
